# EAGLE design TDA7374A (EAGLE 4.14)
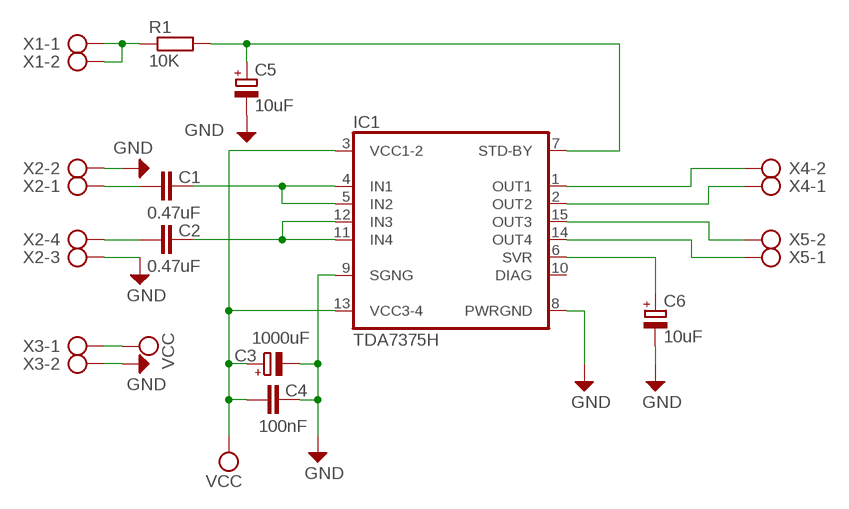
[diagram p0: schematic, sheet 1]

## Parts
C1  0.47uF  C-EU050-035X075  [C050-035X075]
C2  0.47uF  C-EU050-035X075  [C050-035X075]
C3  1000uF  CPOL-EUE5-8.5  [E5-8,5]
C4  100nF  C-EU050-035X075  [C050-035X075]
C5  10uF  CPOL-EUE5-10.5  [E5-10,5]
C6  10uF  CPOL-EUE5-10.5  [E5-10,5]
IC1  TDA7375H  [MULTIWATT-15H]
R1  10K  R-EU_0207/15  [0207/15]
X1  AK300/2  [AK300/2]
X2  AK300/4  [AK300/4]
X3  AK300/2  [AK300/2]
X4  AK300/2  [AK300/2]
X5  AK300/2  [AK300/2]

## Nets
GND: C3.- C4.2 C5.- C6.- IC1.8(PWRGND) IC1.9(SGNG) X2.2 X2.3 X3.2
N$1: C6.+ IC1.6(SVR)
N$2: R1.1 X1.1 X1.2
N$3: C2.2 IC1.11(IN4) IC1.12(IN3)
N$4: IC1.1(OUT1) X4.2
N$5: IC1.2(OUT2) X4.1
N$6: IC1.15(OUT3) X5.2
N$7: IC1.14(OUT4) X5.1
N$8: C5.+ IC1.7(STD-BY) R1.2
N$9: C1.2 IC1.4(IN1) IC1.5(IN2)
N$10: C1.1 X2.1
N$11: C2.1 X2.4
VCC: C3.+ C4.1 IC1.3(VCC1-2) IC1.13(VCC3-4) X3.1
Unconnected: IC1.10(DIAG)

## Library data of the parts
C1 C2 C4 = rcl:C-EU: CAPACITOR, European symbol
C3 C5 C6 = rcl:CPOL-EU: POLARIZED CAPACITOR, European symbol
IC1 = st-tda7375:TDA7375
R1 = rcl:R-EU_: RESISTOR, European symbol
X1 X3-X5 = con-ptr500:AK300/2: CONNECTOR
X2 = con-ptr500:AK300/4: CONNECTOR

## Board
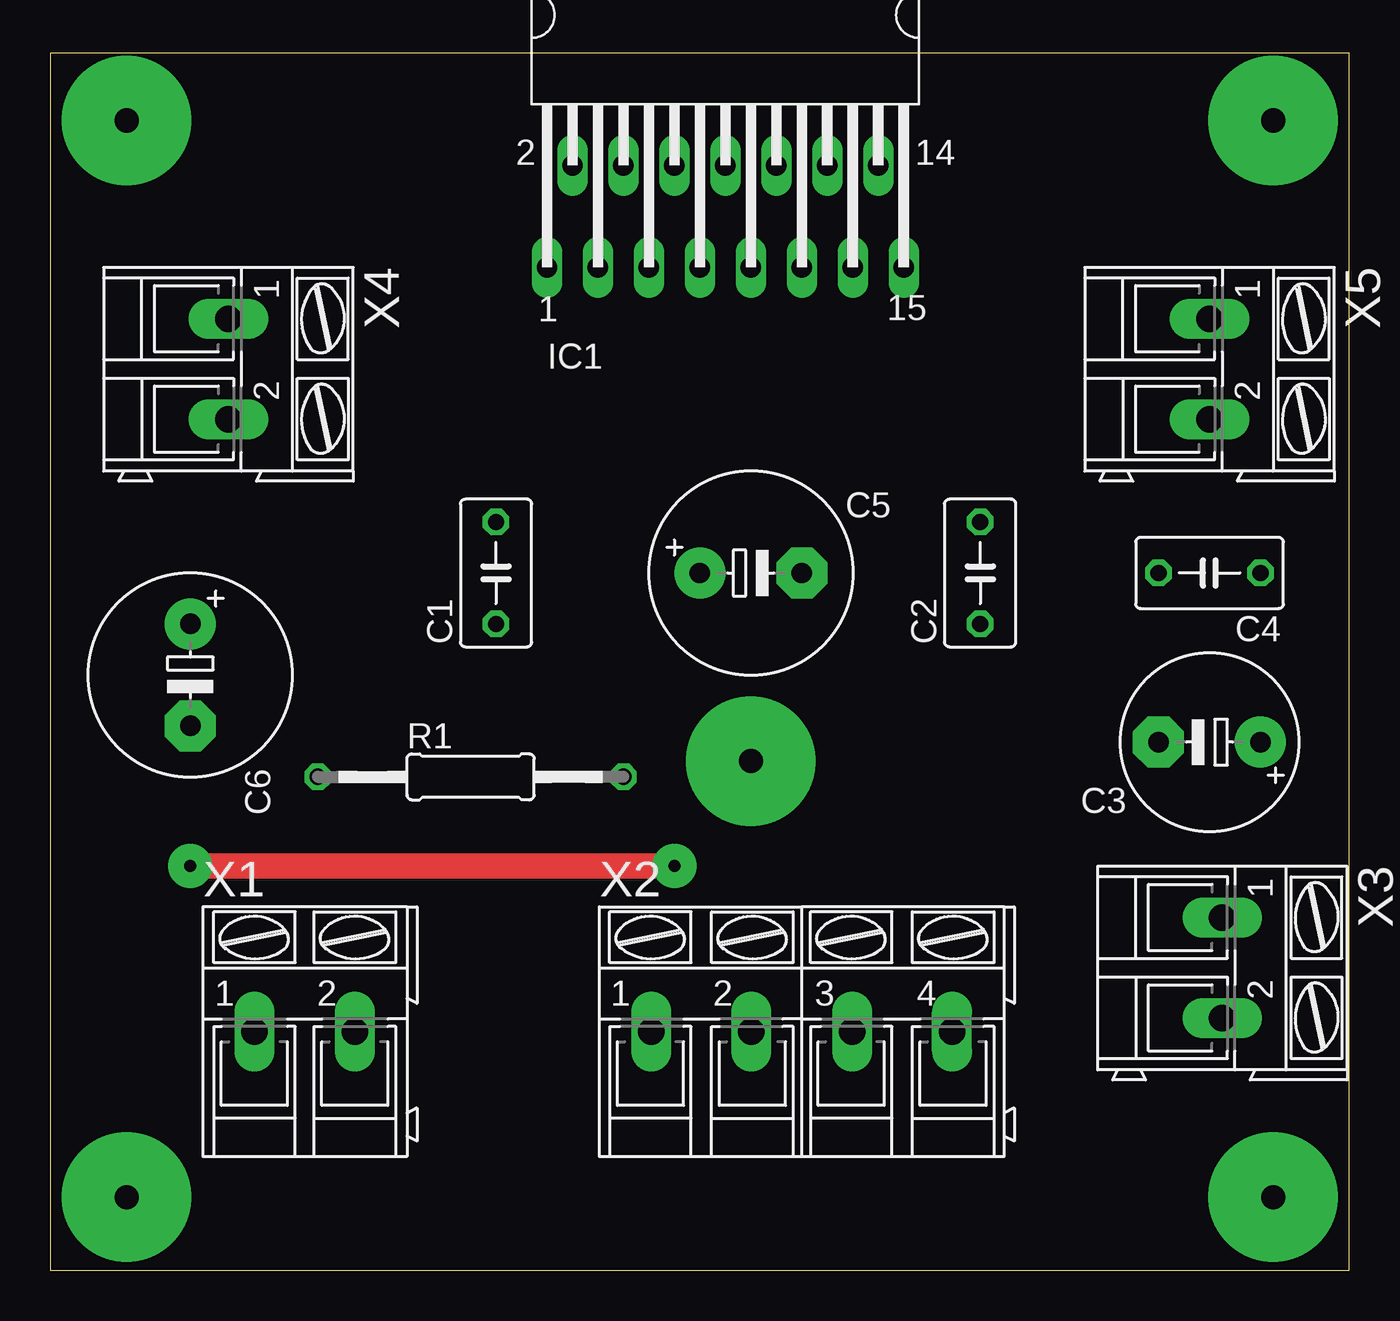
[diagram p1: board, top side]
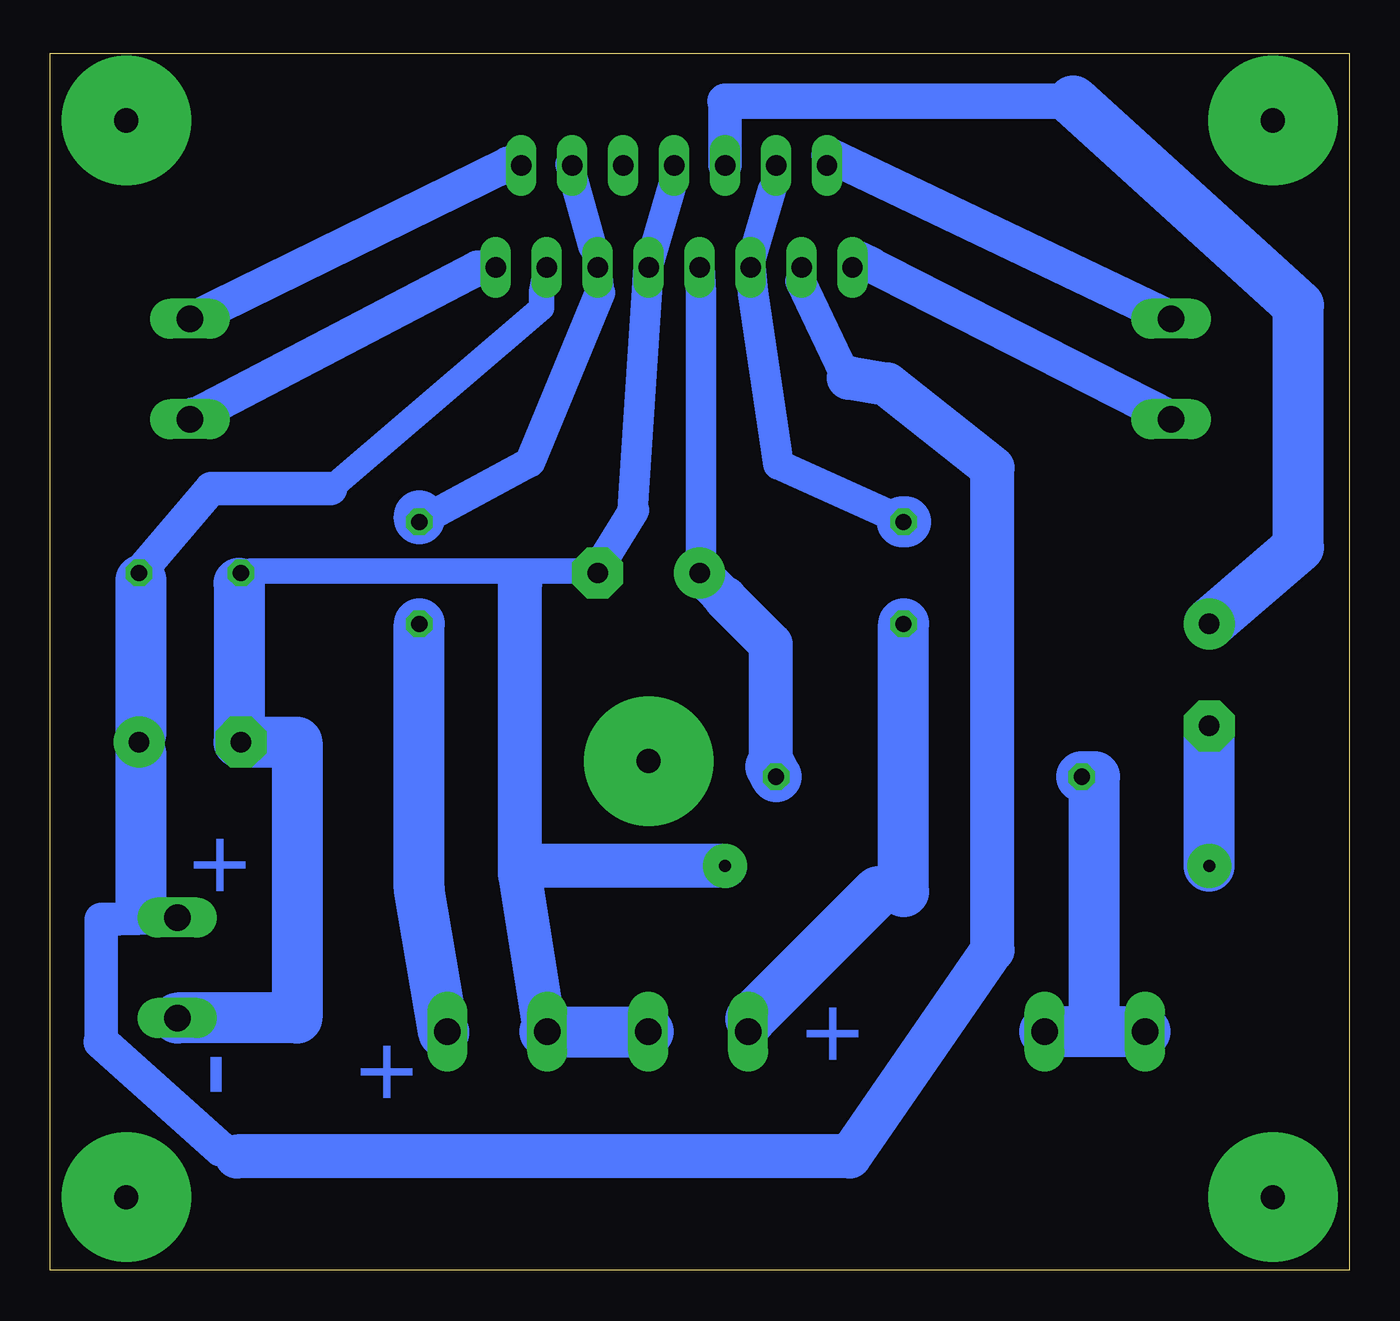
[diagram p2: board, bottom side, seen from below]

Size 64.75 x 60.66 mm. Coordinates in mm from the lower left corner, seen from the top.
Outline: 0,0 64.75,0 64.75,60.66 0,60.66 0,0
Copper layers (1*16): Top 0.035mm / dielectric 1.5mm / Bottom 0.035mm
Design rules "default": minimum track width 50mil, minimum drill 24mil, track to track 8mil, track to pad 8mil, pad to pad 8mil, via to via 8mil, smd to smd 8mil, copper to edge 40mil, drill to drill 8mil, minimum pad ring 10mil, minimum via ring 8mil, stop-mask expansion 4mil, vias tented up to drill 0mil, thermal gap 10mil

### Footprints (pad centres in the part's own frame; a part is rotated, then mirrored left to right if it is on the bottom)
C050-035X075 = drill 0.813 octagon: 1 -2.54,0; 2 2.54,0
E5-8,5 = drill 1.016 pad 2.54 round: + -2.54,0 | drill 1.016 pad 2.54 octagon: - 2.54,0
E5-10,5 = drill 1.016 pad 2.54 round: + -2.54,0 | drill 1.016 pad 2.54 octagon: - 2.54,0
MULTIWATT-15H = drill 1.016 long: 1 -8.89,-5.08; 2 -7.62,0; 3 -6.35,-5.08; 4 -5.08,0; 5 -3.81,-5.08; 6 -2.54,0; 7 -1.27,-5.08; 8 0,0; 9 1.27,-5.08; 10 2.54,0; 11 3.81,-5.08; 12 5.08,0; 13 6.35,-5.08; 14 7.62,0; 15 8.89,-5.08
0207/15 = drill 0.813 octagon: 1 -7.62,0; 2 7.62,0
AK300/2 = drill 1.321 long: 1 -2.515,0; 2 2.489,0
AK300/4 = drill 1.321 long: 1 -7.493,0; 2 -2.515,0; 3 2.515,0; 4 7.493,0

### Placement (x,y rotation side)
C1  22.22,34.76 90 top
C2  46.35,34.76 90 top
C3  57.78,26.33 180 top
C4  57.78,34.76 180 top
C5  34.92,34.76 0 top
C6  6.98,29.68 270 top
IC1  33.65,55.08 0 top
R1  20.95,24.6 0 top
X1  12.7,11.9 0 top
X2  37.46,11.9 0 top
X3  58.42,15.07 270 top
X4  8.88,44.92 270 top
X5  57.78,44.92 270 top

### Tracks (layer width: path | path; a pad name or v marks a point on that pad's centre or on a via)
GND  (via drill 0.6 pad 2.18)
  Top 1.27: v6.98,20.15 v31.11,20.15
  Bottom 0.635: 33.71,54.19 33.52,55.46 33.84,54.7 IC1.8
  Bottom 1.27: X2.2 35.68,12.15 39.49,12.15 X2.3 | 41.02,34.86 54.73,34.86 | 41.02,34.86 37.51,34.86 37.21,35.01 C5.- | 54.73,34.86 C4.2 | v31.11,20.15 31.11,20.23 | 41.32,19.62 41.78,19.77 40.86,20.15 | 41.32,34.25 41.02,34.25 41.02,34.86 | 55.34,34.25 54.73,34.25 54.73,34.86
  Bottom 1.422: IC1.9 33.71,54.19
  Bottom 1.524: IC1.9 35.72,37.85 35.66,37.91 37.54,34.84 | 37.48,34.89 37.33,34.89 C5.-
  Bottom 2.032: C5.- 37.54,34.84
  Bottom 2.184: 40.1,11.9 41.32,19.62 41.32,34.25 | v31.11,20.15 40.86,20.15
  Bottom 2.54: v6.98,20.15 C6.- | 40.1,11.9 X2.2 | X3.2 52.45,12.59 52.45,26.33 C3.- 55.34,26.33 55.34,34.25
N$1
  Bottom 1.676: 31.11,58.28 IC1.6
  Bottom 1.778: 13.76,58.28 31.11,58.28
  Bottom 2.54: 13.76,58.28 2.54,48.1 2.54,36.03 C6.+
N$2
  Bottom 1.676: X1.2 12.7,11.9 | X1.1 10.16,11.9
  Bottom 2.54: 12.7,11.9 12.7,24.6 R1.1 | X1.1 X1.2
N$3
  Bottom 1.27: 38.86,55.14 38.86,55.02 IC1.12 | IC1.11 37.71,51.02
  Bottom 1.422: 37.71,51.02 38.86,55.14 | 37.33,48.73 IC1.11
  Bottom 1.524: C2.2 40.83,40.28 37.33,48.73
N$4
  Bottom 1.27: 23.8,50.1 IC1.1 | X4.2 8.86,42.48
  Bottom 1.778: 23.8,50.1 24.4,50.41 8.86,42.48
N$5
  Bottom 1.27: 25.62,55.13 IC1.2 | X4.1 9.01,47.51
  Bottom 1.778: 25.62,55.13 25.93,55.59 9.01,47.51
N$6
  Bottom 1.27: 43.45,49.95 IC1.15 | 57.63,42.63 X5.2
  Bottom 1.778: 43.45,49.95 57.47,42.63 57.63,42.63
N$7
  Bottom 1.27: IC1.14 41.93,55.13 | 57.63,47.51 X5.1
  Bottom 1.778: 41.93,55.13 57.78,47.36 57.47,47.51 57.63,47.51
N$8
  Bottom 1.524: IC1.7 32.32,48.73 32.32,35.78 C5.+
  Bottom 2.032: 31.11,33.49 32.38,34.81
  Bottom 2.184: 32.38,34.81 C5.+ | 28.82,25.11 28.82,31.2 31.11,33.49
  Bottom 2.54: R1.2 28.82,25.11
N$9
  Bottom 1.27: 28.76,53.87 28.44,55.02 IC1.4 | IC1.5 29.9,50.06
  Bottom 1.422: 29.9,50.06 28.76,53.87
  Bottom 1.524: C1.2 22.12,37.3 22.09,37.3 28.44,40.16 29.71,48.73 IC1.5
  Bottom 2.54: 22.12,37.3 22.27,37.3
N$10
  Bottom 1.27: X2.1 30.35,12.15 29.84,12.54
  Bottom 2.184: 22.22,18.88 23.49,18.88
  Bottom 2.54: 22.22,18.88 C1.1 | 23.49,18.88 29.84,12.54
N$11
  Bottom 2.184: 45.13,11.85 X2.4
  Bottom 2.54: C2.1 46.35,19.01 45.13,11.85
N$12  (via drill 1.2 pad 6.45)
  other vias: 60.95,3.65
N$13  (via drill 1.2 pad 6.45)
  other vias: 60.95,57.32
N$14  (via drill 1.2 pad 6.45)
  other vias: 3.8,57.32
N$15  (via drill 1.2 pad 6.45)
  other vias: 3.8,3.65
N$16  (via drill 1.2 pad 6.45)
  other vias: 34.92,25.39
N$17
  Bottom 2.54: 46.35,37.45 46.35,37.61
VCC
  Bottom 1.27: 60.22,34.4 C4.1 | 60.22,26.78 C3.+ 60.22,25.72 | 50.77,38.98 40.25,47.97 40.25,48.73 IC1.13 | X3.1 60.22,18.4 | 55.43,5.68 56.26,6.06
  Bottom 1.397: 27.36,49.3 IC1.3
  Bottom 1.524: 24.95,44.48 24.95,44.29 27.36,49.3
  Bottom 1.676: 50.77,38.98 56.71,38.98 C4.1 | 62.2,11.39 62.2,17.49 X3.1
  Bottom 1.778: 56.26,6.06 62.2,11.39
  Bottom 2.184: 55.43,5.68 24.89,5.68 17.77,15.96 17.77,39.99 23.03,44.16 24.95,44.48
  Bottom 2.54: 60.22,26.78 60.22,34.4 | 60.22,18.4 60.22,25.72

### Text on the board
Bottom: + | + | + | -